# Altium schematic sheet Pg4-Current  signal condtioning.SchDoc: Analog Front End (Current) + Delfino Interface
size 431 x 279 mm; Date: Not shown in title block; ApprovedBy: Not shown in title block; CheckedBy: Not shown in title block; Author: Not shown in title block; CompanyName: Not shown in title block; Engineer: Not shown in title block; Organization: Not shown in title block; Address1: Not shown in title block; Address2: Not shown in title block; Address3: Not shown in title block; Address4: Not shown in title block; DocumentNumber: 3; Revision: Use project parameter SCH_Rev; SheetNumber: 4; SheetTotal: 9; PageSetup: Record=PageOptions|CenterHorizontal=True|CenterVertical=True|PrintScale=0.62|XCorrection=1.00|YCorrection=1.00|PrintKind=0|BorderSize=5000000|LeftOffset=0|BottomOffset=0|Orientation=2|PaperLength=1000|PaperWidth=1000|Scale=100|PaperSource=15|PrintQuality=600|MediaType=1|DitherType=10|PaperKind=Letter|PrintScaleMode=1; CurrentTime: Not shown in title block; CurrentDate: Not shown in title block; Time: Not shown in title block; DocumentFullPathAndName: Not shown in title block; DocumentName: Not shown in title block; ModifiedDate: Not shown in title block; ImagePath: Not shown in title block
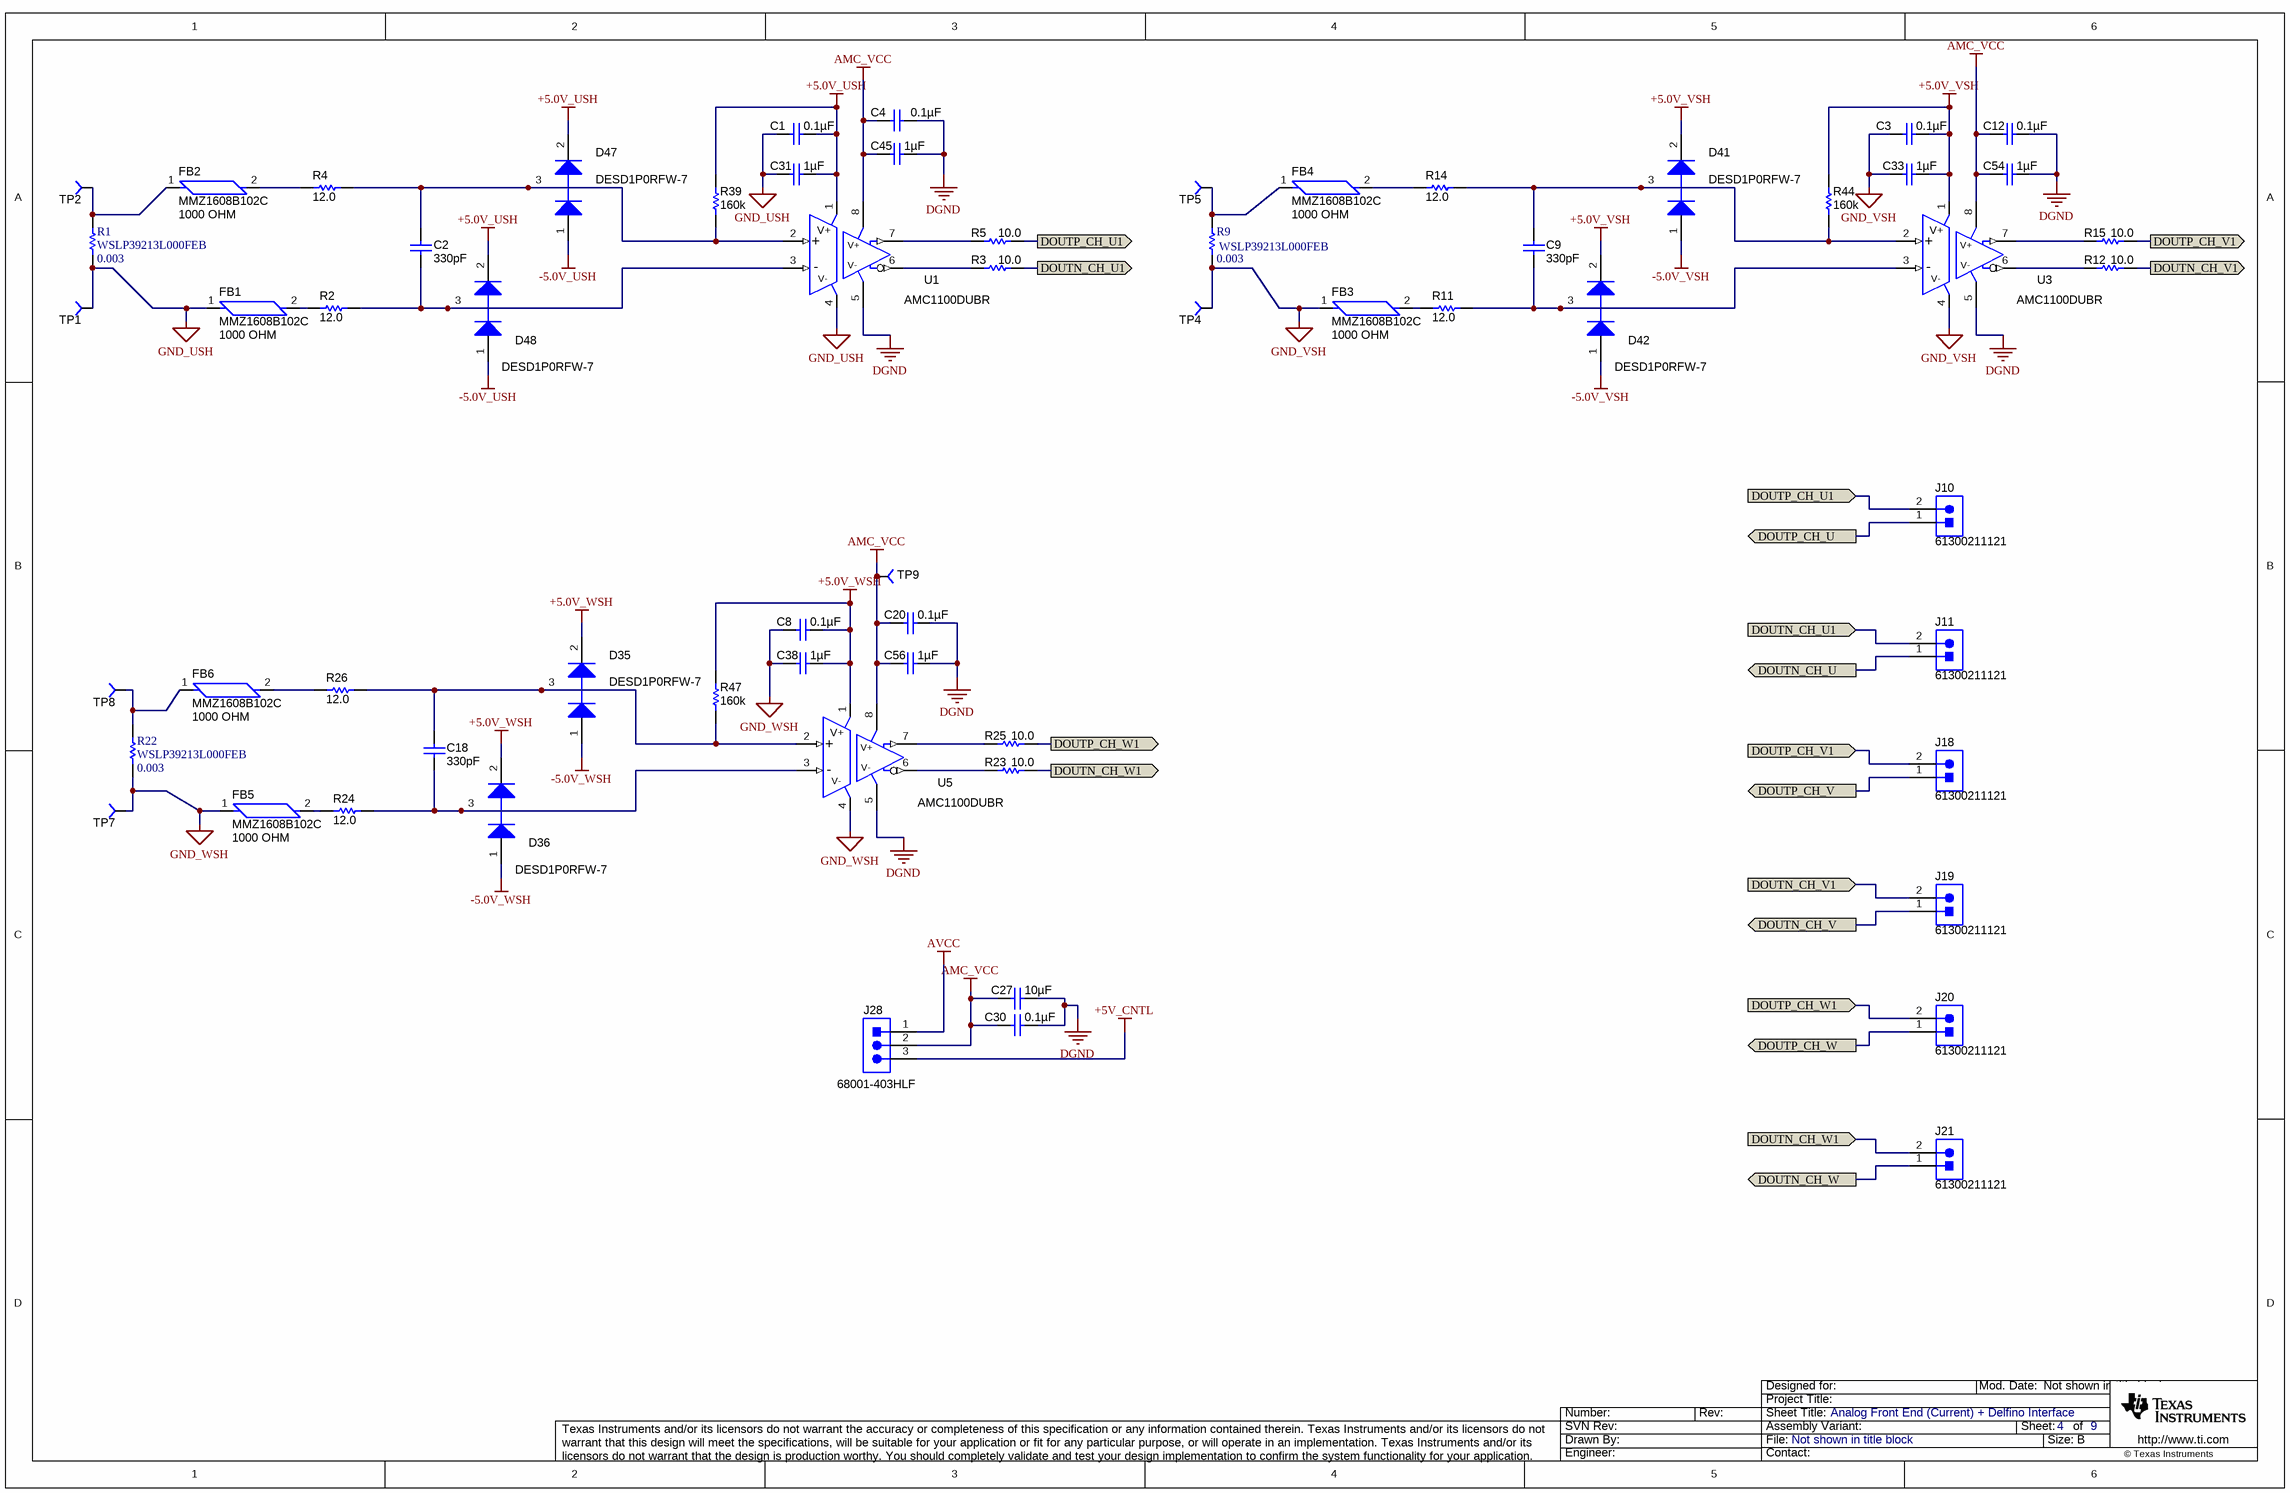
[diagram p0: Pg4-Current  signal condtioning.SchDoc]

## Parts
C1  ValueDisplayed: 0.1µF  [0603]
C2  ValueDisplayed: 330pF  [0805_HV]  (hidden comment: 08055A331KAT2A)
C3  ValueDisplayed: 0.1µF  [0603]
C4  ValueDisplayed: 0.1µF  [0603]
C8  ValueDisplayed: 0.1µF  [0603]
C9  ValueDisplayed: 330pF  [0805_HV]  (hidden comment: 08055A331KAT2A)
C12  ValueDisplayed: 0.1µF  [0603]
C18  ValueDisplayed: 330pF  [0805_HV]  (hidden comment: 08055A331KAT2A)
C20  ValueDisplayed: 0.1µF  [0603]
C27  ValueDisplayed: 10µF  [1210]
C30  ValueDisplayed: 0.1µF  [0603]
C31  ValueDisplayed: 1µF  [0603]  (hidden comment: GRM188R71C105KA12D)
C33  ValueDisplayed: 1µF  [0603]  (hidden comment: GRM188R71C105KA12D)
C38  ValueDisplayed: 1µF  [0603]  (hidden comment: GRM188R71C105KA12D)
C45  ValueDisplayed: 1µF  [0603]  (hidden comment: GRM188R71C105KA12D)
C54  ValueDisplayed: 1µF  [0603]  (hidden comment: GRM188R71C105KA12D)
C56  ValueDisplayed: 1µF  [0603]  (hidden comment: GRM188R71C105KA12D)
D35  value DESD1P0RFW-7  [SOT-323]
D36  value DESD1P0RFW-7  [SOT-323]
D41  value DESD1P0RFW-7  [SOT-323]
D42  value DESD1P0RFW-7  [SOT-323]
D47  value DESD1P0RFW-7  [SOT-323]
D48  value DESD1P0RFW-7  [SOT-323]
FB1  MMZ1608B102C  value 1000 OHM  [FB0603]
FB2  MMZ1608B102C  value 1000 OHM  [FB0603]
FB3  MMZ1608B102C  value 1000 OHM  [FB0603]
FB4  MMZ1608B102C  value 1000 OHM  [FB0603]
FB5  MMZ1608B102C  value 1000 OHM  [FB0603]
FB6  MMZ1608B102C  value 1000 OHM  [FB0603]
J10  61300211121  [WURTH_61300211121]
J11  61300211121  [WURTH_61300211121]
J18  61300211121  [WURTH_61300211121]
J19  61300211121  [WURTH_61300211121]
J20  61300211121  [WURTH_61300211121]
J21  61300211121  [WURTH_61300211121]
J28  68001-403HLF  [HDR1X3]
R1  WSLP39213L000FEB  value 0.003  [RC3921]
R2  ValueDisplayed: 12.0  [0603]  (hidden comment: RC0603FR-0712RL)
R3  value 10.0  [0603]
R4  ValueDisplayed: 12.0  [0603]  (hidden comment: RC0603FR-0712RL)
R5  value 10.0  [0603]
R9  WSLP39213L000FEB  value 0.003  [RC3921]
R11  ValueDisplayed: 12.0  [0603]  (hidden comment: RC0603FR-0712RL)
R12  value 10.0  [0603]
R14  ValueDisplayed: 12.0  [0603]  (hidden comment: RC0603FR-0712RL)
R15  value 10.0  [0603]
R22  WSLP39213L000FEB  value 0.003  [RC3921]
R23  value 10.0  [0603]
R24  ValueDisplayed: 12.0  [0603]  (hidden comment: RC0603FR-0712RL)
R25  value 10.0  [0603]
R26  ValueDisplayed: 12.0  [0603]  (hidden comment: RC0603FR-0712RL)
R39  ValueDisplayed: 160k  [0603]  (hidden comment: CRCW0603160KFKEA)
R44  ValueDisplayed: 160k  [0603]  (hidden comment: CRCW0603160KFKEA)
R47  ValueDisplayed: 160k  [0603]  (hidden comment: CRCW0603160KFKEA)
TP1  TP-5001-BLACK  [TH-40]  (value not drawn)
TP2  TP-5001-BLACK  [TH-40]  (value not drawn)
TP4  TP-5001-BLACK  [TH-40]  (value not drawn)
TP5  TP-5001-BLACK  [TH-40]  (value not drawn)
TP7  TP-5001-BLACK  [TH-40]  (value not drawn)
TP8  TP-5001-BLACK  [TH-40]  (value not drawn)
TP9  (no value)  [TP-040_RND]
U1  AMC1100DUBR  [DUB0008A_N]
U3  AMC1100DUBR  [DUB0008A_N]
U5  AMC1100DUBR  [DUB0008A_N]

## Ports
DOUTN_CH_U1 (in), DOUTN_CH_U1 (out), DOUTN_CH_U (out), DOUTN_CH_V1 (in), DOUTN_CH_V1 (out), DOUTN_CH_V (out), DOUTN_CH_W1 (in), DOUTN_CH_W1 (out), DOUTN_CH_W (out), DOUTP_CH_U1 (in), DOUTP_CH_U1 (out), DOUTP_CH_U (out), DOUTP_CH_V1 (in), DOUTP_CH_V1 (out), DOUTP_CH_V (out), DOUTP_CH_W1 (in), DOUTP_CH_W1 (out), DOUTP_CH_W (out)

## Nets
+5.0V_USH: C1.1 C31.2 D47.2(K) D48.2(K) R39.2 U1.1(VDD1)
+5.0V_VSH: C3.1 C33.2 D41.2(K) D42.2(K) R44.2 U3.1(VDD1)
+5.0V_WSH: C8.1 C38.2 D35.2(K) D36.2(K) R47.2 U5.1(VDD1)
+5V_CNTL: J28.3
-5.0V_USH: D47.1(A) D48.1(A)
-5.0V_VSH: D41.1(A) D42.1(A)
-5.0V_WSH: D35.1(A) D36.1(A)
AMC_VCC: C4.2 C12.2 C20.2 C27.1 C30.1 C45.1 C54.1 C56.1 J28.2 TP9.1 U1.8(VDD2) U3.8(VDD2) U5.8(VDD2)
AVCC: J28.1
DGND: C4.1 C12.1 C20.1 C27.2 C30.2 C45.2 C54.2 C56.2 U1.5(GND2) U3.5(GND2) U5.5(GND2)
GND_USH: C1.2 C31.1 FB1.1 R1.1 TP1.1 U1.4(GND1)
GND_VSH: C3.2 C33.1 FB3.1 R9.1 TP4.1 U3.4(GND1)
GND_WSH: C8.2 C38.1 FB5.1 R22.1 TP7.1 U5.4(GND1)
DOUTN_CH_U: J11.1 ; port DOUTN_CH_U
DOUTN_CH_U1: J11.2 R3.2 ; port DOUTN_CH_U1
DOUTN_CH_V: J19.1 ; port DOUTN_CH_V
DOUTN_CH_V1: J19.2 R12.2 ; port DOUTN_CH_V1
DOUTN_CH_W: J21.1 ; port DOUTN_CH_W
DOUTN_CH_W1: J21.2 R23.2 ; port DOUTN_CH_W1
DOUTP_CH_U: J10.1 ; port DOUTP_CH_U
DOUTP_CH_U1: J10.2 R5.2 ; port DOUTP_CH_U1
DOUTP_CH_V: J18.1 ; port DOUTP_CH_V
DOUTP_CH_V1: J18.2 R15.2 ; port DOUTP_CH_V1
DOUTP_CH_W: J20.1 ; port DOUTP_CH_W
DOUTP_CH_W1: J20.2 R25.2 ; port DOUTP_CH_W1
NetC2_1: C2.1 D47.3(C) R4.2 R39.1 U1.2(VINP)
NetC2_2: C2.2 D48.3(C) R2.2 U1.3(VINN)
NetC9_1: C9.1 D41.3(C) R14.2 R44.1 U3.2(VINP)
NetC9_2: C9.2 D42.3(C) R11.2 U3.3(VINN)
NetC18_1: C18.1 D35.3(C) R26.2 R47.1 U5.2(VINP)
NetC18_2: C18.2 D36.3(C) R24.2 U5.3(VINN)
NetFB1_2: FB1.2 R2.1
NetFB2_1: FB2.1 R1.2 TP2.1
NetFB2_2: FB2.2 R4.1
NetFB3_2: FB3.2 R11.1
NetFB4_1: FB4.1 R9.2 TP5.1
NetFB4_2: FB4.2 R14.1
NetFB5_2: FB5.2 R24.1
NetFB6_1: FB6.1 R22.2 TP8.1
NetFB6_2: FB6.2 R26.1
NetR3_1: R3.1 U1.6(VOUTN)
NetR5_1: R5.1 U1.7(VOUTP)
NetR12_1: R12.1 U3.6(VOUTN)
NetR15_1: R15.1 U3.7(VOUTP)
NetR23_1: R23.1 U5.6(VOUTN)
NetR25_1: R25.1 U5.7(VOUTP)

## Notes on the sheet
- Drawn By:
- SVN Rev:
- Number:
- Rev:
- Sheet Title:
- File:
- Project Title:
- Designed for:
- Assembly Variant:
- Mod. Date:
- Sheet:
- Size:
- of
- B
- http://www.ti.com
- Texas Instruments and/or its licensors do not warrant the accuracy or completeness of this specification or any information contained therein. Texas Instruments and/or its licensors do not warrant that this design will meet the specifications, will be suitable for your application or fit for any particular purpose, or will operate in an implementation. Texas Instruments and/or its licensors do not warrant that the design is production worthy. You should completely validate and test your design implementation to confirm the system functionality for your application.
- Engineer:
- Contact:
- © Texas Instruments
- (in symbol AMC1100DUBR) V+; +; -; V-

## Library data of the parts
C1 C3 C4 C8 C12 C20 = 06033C104JAT2A: CAP, CERM, 0.1uF, 25V, +/-5%, X7R, 0603; Manufacturer: AVX; Polarized: N; CompType: Capacitor; U/M: EA; Cap_F: 0.0000001; Tolerance_%: 5; ESR_Ohm: 0.05; Value1: 0.05 ohm; VDC_V: 25; TaMin_C: -55; TaMax_C: 125; SymbolVersion: 2008-07-09; Value: 0.1uF; PartNumber: 06033C104JAT2A; PackageReference: 0603; RoHS: Y; Value2: 25V; MountType: SMT; Technology: Ceramic; TempCo: X7R; Cap_Case: 0603; Published: 2008-06-19; Publisher: Texas Instruments; LatestRevisionDate: 2013-12-06; ComponentLink1Description: Datasheet link; ComponentLink1URL: http://www.avx.com/docs/masterpubs/smccp.pdf; Supplier 1: Digi-Key; Supplier Part Number 1: 478-3713-1-ND; Supplier 2: Mouser; Supplier Part Number 2: 581-06033C104JAT2A; Supplier 3: Farnell; Supplier Part Number 3: 1740614
C2 C9 C18 = 08055A331KAT2A: CAP, CERM, 330 pF, 50 V, +/- 10%, C0G/NP0, 0805; Manufacturer: AVX; Polarized: N; CompType: Capacitor; Value: 330pF; U/M: EA; Cap_F: 0.00000000033; Tolerance_%: 10; ESR_ohm: 0.189; Value1: 0.189 ohm; VDC_V: 50; Value2: 50V; TaMin_C: -55; TaMax_C: 125; Cap_Case: 0805; SymbolVersion: 2008-07-09; PartNumber: 08055A331KAT2A; PackageReference: 0805; RoHS: Y; MountType: SMT; Technology: Ceramic; TempCo: C0G/NP0; Published: 2008-06-19; Publisher: Texas Instruments; LatestRevisionDate: 2015-02-10; ComponentLink1Description: Datasheet link; ComponentLink1URL: http://www.avx.com/docs/masterpubs/smccp.pdf; Supplier 1: Digi-Key; Supplier Part Number 1: 478-3765-1-ND; Supplier 2: Mouser; Supplier Part Number 2: 581-08055A331K; Supplier 3: Farnell; Supplier Part Number 3: 1582411
C27 = GMK325AB7106MM-T: CAP, CERM, 10uF, 35V, +/-20%, X7R, 1210; Manufacturer: Taiyo Yuden; Polarized: N; CompType: Capacitor; U/M: EA; Cap_F: 0.00001; Tolerance_%: 20; Value1: Unknown; VDC_V: 35; TaMin_C: -55; TaMax_C: 125; PackageReference: 1210; PartNumber: GMK325AB7106MM-T; SymbolVersion: 2008-07-09; Value: 10uF; RoHS: Y; Value2: 35V; MountType: SMT; Technology: Ceramic; Cap_Case: 1210; Publisher: Texas Instruments; LatestRevisionDate: 2013-12-06; ComponentLink1Description: Datasheet link; ComponentLink1URL: http://www.yuden.co.jp/productdata/catalog/en/mlcc01_e.pdf; Supplier 1: Digi-Key; Supplier Part Number 1: 587-2779-1-ND; Supplier 2: Mouser; Supplier Part Number 2: 963-GMK325AB7106MM-T; Supplier 3: Farnell; Supplier Part Number 3: 1894510; TempCo: X7R; Published: 2008-06-19
C30 = C0603C104K5RACTU: CAP, CERM, 0.1uF, 50V, +/-10%, X7R, 0603; Manufacturer: Kemet; Polarized: N; CompType: Capacitor; U/M: EA; Cap_F: 0.0000001; Tolerance_%: 10; Value1: Unknown; VDC_V: 50; TaMin_C: -55; TaMax_C: 125; SymbolVersion: 2008-07-09; Value: 0.1uF; PartNumber: C0603C104K5RACTU; PackageReference: 0603; RoHS: Y; Value2: 50V; MountType: SMT; Technology: Ceramic; TempCo: X7R; Cap_Case: 0603; Published: 2008-06-19; Publisher: Texas Instruments; LatestRevisionDate: 2013-12-06; ComponentLink1Description: Datasheet link; ComponentLink1URL: http://www.kemet.com/kemet/web/homepage/kechome.nsf/vapubfiles/F3102_Y5V.pdf/$file/F3102_Y5V.pdf; Supplier 1: Digi-Key; Supplier Part Number 1: 399-5089-1-ND; Supplier 2: Mouser; Supplier Part Number 2: 80-C0603C104K5R; Supplier 3: Farnell; Supplier Part Number 3: 1288255
C31 C33 C38 C45 C54 C56 = GRM188R71C105KA12D: CAP, CERM, 1 µF, 16 V, +/- 10%, X7R, 0603; Manufacturer: MuRata; Polarized: N; CompType: Capacitor; Value: 1uF; U/M: EA; Cap_F: 0.000001; Tolerance_%: 10; ESR_ohm: 0.011; Value1: 0.011 ohm; VDC_V: 16; Value2: 16V; TaMin_C: -55; TaMax_C: 125; SymbolVersion: 2008-07-09; PartNumber: GRM188R71C105KA12D; PackageReference: 0603; RoHS: Y; MountType: SMT; Technology: Ceramic; TempCo: X7R; Cap_Case: 0603; Published: 2008-06-19; Publisher: Texas Instruments; LatestRevisionDate: 2015-02-10; ComponentLink1Description: Datasheet link; ComponentLink1URL: http://search.murata.co.jp/Ceramy/PnsearchViewAction.do?HnOFG=ON&HnNFG=ON&SEL_CNT=50&sLang=en&sKey=GRM188R71C105KA12D&x=9&y=9&search=startwith; Supplier 1: Digi-Key; Supplier Part Number 1: 490-3900-1-ND; Supplier 2: Mouser; Supplier Part Number 2: 81-GRM188R71C105KA12; Supplier 3: Farnell; Supplier Part Number 3: 1828826
D35 D36 D41 D42 D47 D48 = BAV99WT1G: Diode, P-N, 70V, 0.2A, SOT-323; Manufacturer: Diodes Inc; SymbolVersion: 2011-08-17; PartNumber: DESD1P0RFW-7; PackageReference: SOT-323; CompType: Diode; MountType: SMT; Type: P-N; RoHS: Y; Published: 2008-06-26; Publisher: Texas Instruments; LatestRevisionDate: 2013-11-22; ComponentLink1Description: Datasheet link; ComponentLink1URL: http://www.diodes.com/datasheets/DESD1P0RFW.pdf; Supplier 1: Digi-Key; Supplier Part Number 1: DESD1P0RFW-7DIDKR-ND; Supplier 2: Mouser; Supplier Part Number 2: 512-BAV99WT1G
FB1-FB6 = MMZ1608B102C: FERRITE CHIP 1000 OHM 300MA 0603; Manufacturer: TDK Corporation; CompType: Ferrite Bead; PartNumber: MMZ1608B102C; MountType: SMT; Alternate PartNumber: *; Supplier 1: Digi-Key; ComponentLink1URL: http://www.tdk.co.jp/tefe02/e9412_mmz.pdf; ComponentLink1Description: Datasheet link; Publisher: TI; Supplier Part Number 1: 445-8672-1-ND; PackageReference: 0603; Alternate Manufacturer: *; RoHS: Y
J10 J11 J18-J21 = 61300211121: Header, 2.54 mm, 2x1, Gold, TH; Manufacturer: Wurth Elektronik eiSos; SymbolCreator: a0412235; U/M: EA; SymbolVersion: 2013-10-31; PartNumber: 61300211121; PackageReference: Header, 2.54mm, 2x1, TH; CompType: Header; RoHS: Y; MountType: TH; ComponentLink1Description: Datasheet Link; ComponentLink1URL: http://katalog.we-online.de/em/datasheet/6130xx11121.pdf; Publisher: Texas Instruments; LatestRevisionDate: 2014-11-22; Supplier 1: Digi-Key; Supplier Part Number 1: 732-5315-ND; Supplier 2: Mouser; Supplier Part Number 2: 710-61300211121; Supplier 3: Farnell; Supplier Part Number 3: 2356153; ClassName: Header
J28 = 009155003301006: 3 pin berger; Manufacturer: FCI; SymbolCreator: a0799628; CompType: Connector; U/M: EA; SymbolVersion: 2013-03-28; PartNumber: 68001-403HLF; PackageReference: Connector,RA, Battery 3Pos, 3mm Pitch; RoHS: Y; MountType: SMT; ComponentLink1Description: Datasheet Link; ComponentLink1URL: http://www.avx.com/docs/catalogs/9155-5.pdf; Publisher: Texas Instruments; LatestRevisionDate: 2014-05-15; Supplier 1: Digi-Key; Supplier Part Number 1: 609-3471-ND; Supplier 2: Mouser
R1 R9 R22 = WSLP39213L000FEB: RESISTOR, SMD, 0.003 OHM, 1%, 5W, 3921; Manufacturer: VISHAY DALE; SymbolCreator: x0199378; ComponentLink1Description: Data sheet Link; ComponentLink1URL: http://www.vishay.com/docs/30176/wslp3921.pdf; CompType: RESISTOR; MountType: SMT; PartNumber: WSLP39213L000FEB; RoHS: Y; SymbolVersion: 2015-04-24
R2 R4 R11 R14 R24 R26 = RC0603FR-0712RL: RES, 12.0, 1%, 0.1 W, 0603; Manufacturer: Yageo America; CompType: Resistor; Value: 12.0; Res_ohm: 12; Value_Code: 12R0; Tolerance_%: 1; Power_W: 0.1; Value2: 0.1W; VDC_V: 150; TempCo: 200 ppm/C; U/M: EA; SymbolVersion: 2009-05-29; PartNumber: RC0603FR-0712RL; PackageReference: 0603; RoHS: Y; Value1: 1%; MountType: SMT; Technology: Thick Film; Published: 2008-06-26; Publisher: Texas Instruments; LatestRevisionDate: 2014-12-16; ComponentLink1Description: Datasheet link; ComponentLink1URL: http://www.yageo.com/pdf/Pu-RC0603_51_PbFree_L_2.pdf; Supplier 1: Digi-Key; Supplier Part Number 1: 311-12.0HRCT-ND; Supplier 2: Mouser; Supplier Part Number 2: 603-RC0603FR-0712RL; Supplier 3: Farnell; Supplier Part Number 3: 9238255
R3 R5 R12 R15 R23 R25 = CRCW060310R0FKEA: RES, 10.0 ohm, 1%, 0.1W, 0603; Manufacturer: Vishay-Dale; CompType: Resistor; Res_ohm: 10; Value_Code: 10R0; Tolerance_%: 1; Power_W: 0.1; VDC_V: 75; TempCo: 100 ppm/C; EIA_Code: E96; U/M: EA; SymbolVersion: 2009-05-29; PartNumber: CRCW060310R0FKEA; PackageReference: 0603; RoHS: Y; Value1: 1%; Value2: 0.1W; MountType: SMT; Technology: Thick Film; Published: 2008-06-26; Publisher: Texas Instruments; LatestRevisionDate: 2013-10-22; ComponentLink1Description: Datasheet link; ComponentLink1URL: http://www.vishay.com/docs/20035/dcrcwe3.pdf; Supplier 1: Digi-Key; Supplier Part Number 1: 541-10.0HCT-ND; Supplier 2: Mouser; Supplier Part Number 2: 71-CRCW0603-10-E3; Supplier 3: Farnell; Supplier Part Number 3: 1469751
R39 R44 R47 = CRCW0603160KFKEA: RES, 160 k, 1%, 0.1 W, 0603; Manufacturer: Vishay-Dale; CompType: Resistor; Value: 160k; Res_ohm: 160000; Tolerance_%: 1; Power_W: 0.1; Value2: 0.1W; VDC_V: 75; TempCo: 100 ppm/C; U/M: EA; SymbolVersion: 2009-05-29; PartNumber: CRCW0603160KFKEA; PackageReference: 0603; RoHS: Y; Value_Code: 160k; Value1: 1%; MountType: SMT; Technology: Thick Film; Published: 2008-06-26; Publisher: Texas Instruments; LatestRevisionDate: 2015-04-01; ComponentLink1Description: Datasheet link; ComponentLink1URL: http://www.vishay.com/docs/20035/dcrcwe3.pdf; Supplier 1: Digi-Key; Supplier Part Number 1: 541-160KHCT-ND; Supplier 2: Mouser; Supplier Part Number 2: 71-CRCW0603-160K-E3; Supplier 3: Farnell; Supplier Part Number 3: 1151729
TP1 TP2 TP4 TP5 TP7 TP8 = TP-5001-BLACK: Test Point,  Black, Thru Hole Color Keyed; Manufacturer: Keystone; PartNumber: 5001; area: 10.000; Value: 5001; ComponentLink1URL: \\vette02\pmp_pcb\pcad_pdf's\Keystone-SMT-TH_Test point.pdf; ComponentHeight: 0.180 inch; SymbolVersion: 11/01/2006 14:05:33; PackageReference: 0.100 x 0.100 inch; ComponentLink1Description: AEO Datasheet Link
TP9 = TP-040_RND: Test Point, O.040 Hole; Manufacturer: STD; Value: STD; area: *; SymbolVersion: 06/30/2008 16:03:57; PartNumber: STD; ComponentLink1Description: AEO Datasheet Link
U1 U3 U5 = AMC1100DUBR: Fully-Differential Isolation Amplifier, DUB0008A; Manufacturer: Texas Instruments; SymbolCreator: a0411947; CompType: IC; U/M: EA; SymbolVersion: 2013-07-01; PartNumber: AMC1100DUBR; Alternate PartNumber: AMC1100DUB; PackageReference: DUB0008A; MountType: SMT; ComponentLink1Description: Datasheet Link; ComponentLink1URL: https://sps06.itg.ti.com/sites/KMS/crossdivteams/altium/docs/ComponentDatasheets/AMC1200.pdf; RoHS: Y; Publisher: Texas Instruments; LatestRevisionDate: 2015-02-10; Alternate Manufacturer: Texas Instruments